# EAGLE design TCC_COMPLETO-jalim3 (EAGLE 4.16)
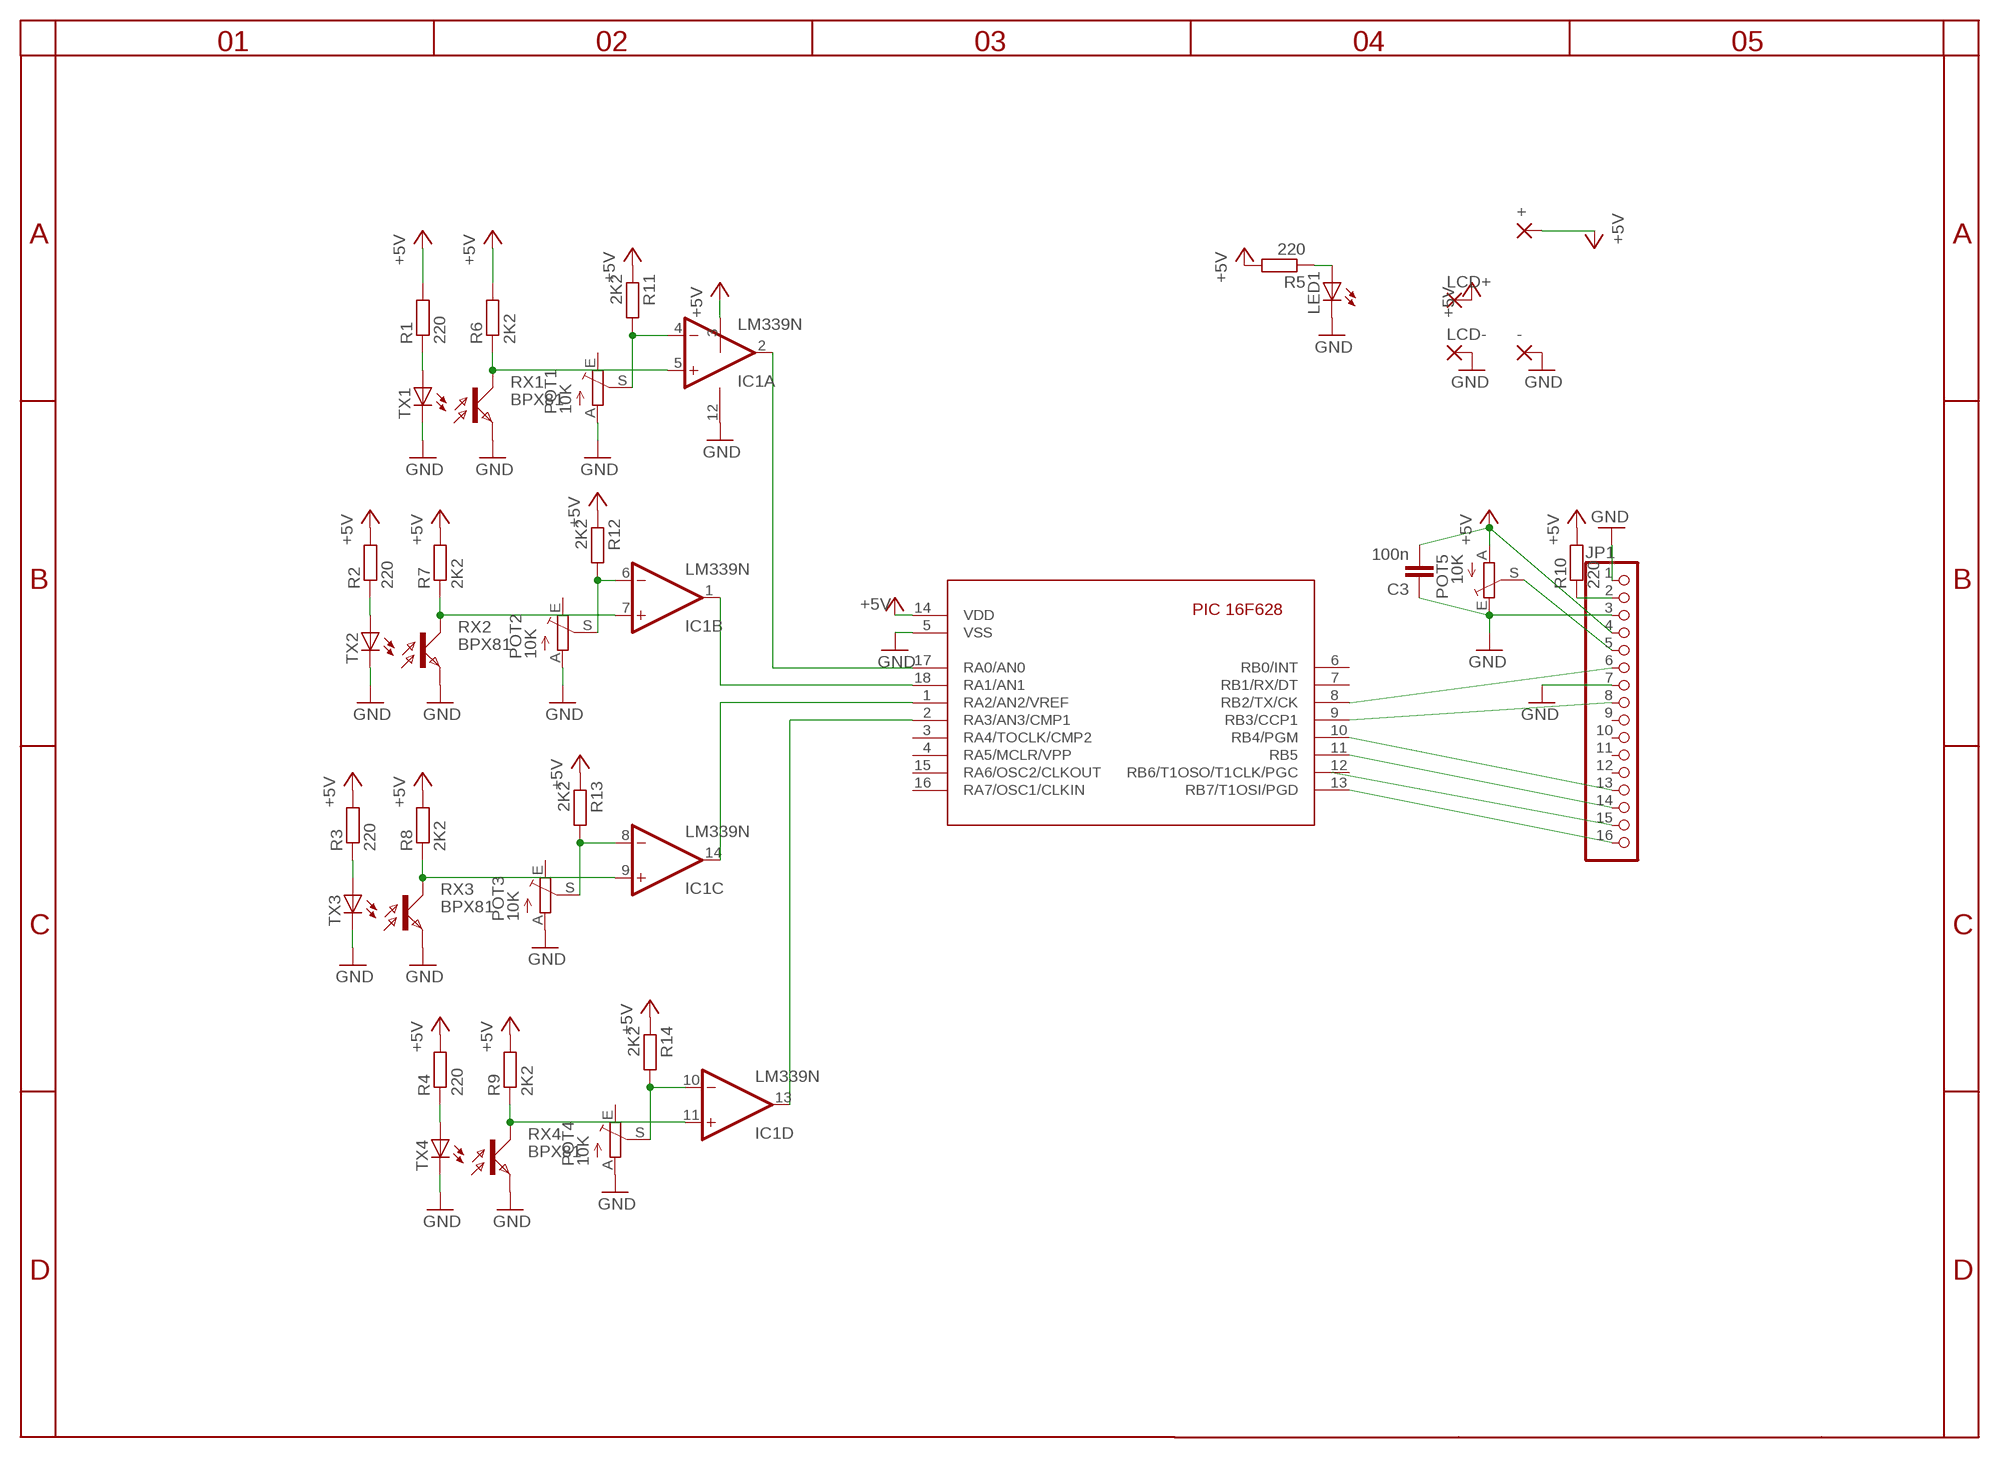
[diagram p0: schematic, sheet 1]

## Parts
+  2,54/1,0  [2,54/1,0]
-  2,54/1,0  [2,54/1,0]
C3  100n  CYYC7B5  [YC7B5]
IC1  LM339N  [DIL14]
JP1  PINHD-1X16  [1X16]
LCD+  2,54/1,0  [2,54/1,0]
LCD-  2,54/1,0  [2,54/1,0]
LED1  LED5MM  [LED5MM]
POT1  10K  TRIM_EU-LI10  [LI10]
POT2  10K  TRIM_EU-LI10  [LI10]
POT3  10K  TRIM_EU-LI10  [LI10]
POT4  10K  TRIM_EU-LI10  [LI10]
POT5  10K  TRIM_EU-LI10  [LI10]
R1  220  R-EU_0207/10  [0207/10]
R2  220  R-EU_0207/10  [0207/10]
R3  220  R-EU_0207/10  [0207/10]
R4  220  R-EU_0207/10  [0207/10]
R5  220  R-EU_0207/10  [0207/10]
R6  2K2  R-EU_0207/10  [0207/10]
R7  2K2  R-EU_0207/10  [0207/10]
R8  2K2  R-EU_0207/10  [0207/10]
R9  2K2  R-EU_0207/10  [0207/10]
R10  220  R-EU_0207/10  [0207/10]
R11  2K2  R-EU_0207/10  [0207/10]
R12  2K2  R-EU_0207/10  [0207/10]
R13  2K2  R-EU_0207/10  [0207/10]
R14  2K2  R-EU_0207/10  [0207/10]
RX1  BPX81  [BPX81]
RX2  BPX81  [BPX81]
RX3  BPX81  [BPX81]
RX4  BPX81  [BPX81]
TX1  LED5MM  [LED5MM]
TX2  LED5MM  [LED5MM]
TX3  LED5MM  [LED5MM]
TX4  LED5MM  [LED5MM]
U$1  16F628  [PIC16F628-18-LEAD-PDIP]

## Nets
+5V: +.1(P) C3.2 IC1.3(P:V+) JP1.4 LCD+.1(P) POT5.A R1.2 R2.2 R3.2 R4.2 R5.2 R6.2 R7.2 R8.2 R9.2 R10.2 R11.1 R12.1 R13.1 R14.1 U$1.14(VDD)
GND: -.1(P) C3.1 IC1.12(P:GND) JP1.1 JP1.3 JP1.7 LCD-.1(P) LED1.K(C) POT1.A POT2.A POT3.A POT4.A POT5.E RX1.E RX2.E RX3.E RX4.E TX1.K(C) TX2.K(C) TX3.K(C) TX4.K(C) U$1.5(VSS)
N$1: JP1.6 U$1.8(RB2/TX/CK)
N$2: JP1.8 U$1.9(RB3/CCP1)
N$3: JP1.16 U$1.13(RB7/T1OSI/PGD)
N$4: JP1.15
N$5: JP1.14 U$1.11(RB5)
N$6: JP1.13 U$1.10(RB4/PGM)
N$8: LED1.A R5.1
N$9: JP1.2 R10.1
N$10: JP1.5 POT5.S
N$11: IC1.9(C:+IN) R8.1 RX3.C
N$12: IC1.4(A:-IN) POT1.S R11.2
N$13: IC1.6(B:-IN) POT2.S R12.2
N$14: IC1.8(C:-IN) POT3.S R13.2
N$15: IC1.10(D:-IN) POT4.S R14.2
N$18: R1.1 TX1.A
N$19: R2.1 TX2.A
N$20: R3.1 TX3.A
N$21: R4.1 TX4.A
N$22: IC1.5(A:+IN) R6.1 RX1.C
N$24: IC1.11(D:+IN) R9.1 RX4.C
N$26: IC1.2(A:OUT) U$1.17(RA0/AN0)
N$31: IC1.1(B:OUT) U$1.18(RA1/AN1)
N$32: IC1.14(C:OUT) U$1.1(RA2/AN2/VREF)
N$33: IC1.13(D:OUT) U$1.2(RA3/AN3/CMP1)
N$34: IC1.7(B:+IN) R7.1 RX2.C
Unconnected: JP1.9 JP1.10 JP1.11 JP1.12 POT1.E POT2.E POT3.E POT4.E U$1.3(RA4/TOCLK/CMP2) U$1.4(RA5/MCLR/VPP) U$1.6(RB0/INT) U$1.7(RB1/RX/DT) U$1.12(RB6/T1OSO/T1CLK/PGC) U$1.15(RA6/OSC2/CLKOUT) U$1.16(RA7/OSC1/CLKIN)

## Library data of the parts
+ - LCD+ LCD- = wirepad:2,54/1,0: THROUGH-HOLE PAD
C3 = rcl:CY: Y CAPACITOR for power line
IC1 = linear:LM339: Low Power Low Offset Voltage Quad Comparators with open collector; LM139/LM239/LM339/LM2901/LM3302
JP1 = pinhead:PINHD-1X16: PIN HEADER
LED1 TX1-TX4 = led:LED: LED OSRAM: - CHIPLED LG R971, LG N971, LY N971, LG Q971, LY Q971, LO R971, LY R971 LH N974, LH R974 LS Q976, LO Q976, LY Q976 LO Q996 - Hyper CHIPLED LW Q18S LB Q993, LB Q99A, LB R99A - SideLED LS A670, LO A670, LY A670, LG A670, LP A670 LB A673, LV A673, LT A673, LW A673 LH A674 LY A675 LS A676, LA A676, LO A676, LY A676, LW A676 LS A679, LY A679, LG A679 - Hyper Micro SIDELED® LS Y876, LA Y876, LO Y876, LY Y876 LT Y87S - SmartLED LW L88C, LW L88S LB L89C, LB L89S, LG L890 LS L89K, LO L89K, LY L89K LS L896, LA L896, LO L896, LY L896 - TOPLED LS T670, LO T670, LY T670, LG T670, LP T670 LSG T670, LSP T670, LSY T670, LOP T670, LYG T670 LG T671, LOG T671, LSG T671 LB T673, LV T673, LT T673, LW T673 LH T674 LS T676, LA T676, LO T676, LY T676, LB T676, LH T676, LSB T676, LW T676 LB T67C, LV T67C, LT T67C, LS T67K, LO T67K, LY T67K, LW E67C LS E67B, LA E67B, LO E67B, LY E67B, LB E67C, LV E67C, LT E67C LW T67C LS T679, LY T679, LG T679 LS T770, LO T770, LY T770, LG T770, LP T770 LB T773, LV T773, LT T773, LW T773 LH T774 LS E675, LA E675, LY E675, LS T675 LS T776, LA T776, LO T776, LY T776, LB T776 LHGB T686 LT T68C, LB T68C - Hyper Mini TOPLED® LB M676 - Mini TOPLED Santana® LG M470 LS M47K, LO M47K, LY M47K Source: http://www.osram.convergy.de - LUMILED® LXK2-PW12-R00, LXK2-PW12-S00, LXK2-PW14-U00, LXK2-PW14-V00 LXK2-PM12-R00, LXK2-PM12-S00, LXK2-PM14-U00 LXK2-PE12-Q00, LXK2-PE12-R00, LXK2-PE12-S00, LXK2-PE14-T00, LXK2-PE14-U00 LXK2-PB12-K00, LXK2-PB12-L00, LXK2-PB12-M00, LXK2-PB14-N00, LXK2-PB14-P00, LXK2-PB14-Q00 LXK2-PR12-L00, LXK2-PR12-M00, LXK2-PR14-Q00, LXK2-PR14-R00 LXK2-PD12-Q00, LXK2-PD12-R00, LXK2-PD12-S00 LXK2-PH12-R00, LXK2-PH12-S00 LXK2-PL12-P00, LXK2-PL12-Q00, LXK2-PL12-R00 Source: www.luxeon.com
POT1-POT5 = pot:TRIM_EU-: POTENTIOMETER
R1-R14 = rcl:R-EU_: RESISTOR, European symbol
RX1-RX4 = opto-trans-siemens:BPX81: PHOTO TRANSISTOR
U$1 = pic16f6xx-1:16F628: Microchip component PIC 16F628 Eric Magraner - eric_magraner@yahoo.fr 03/2004

## Board
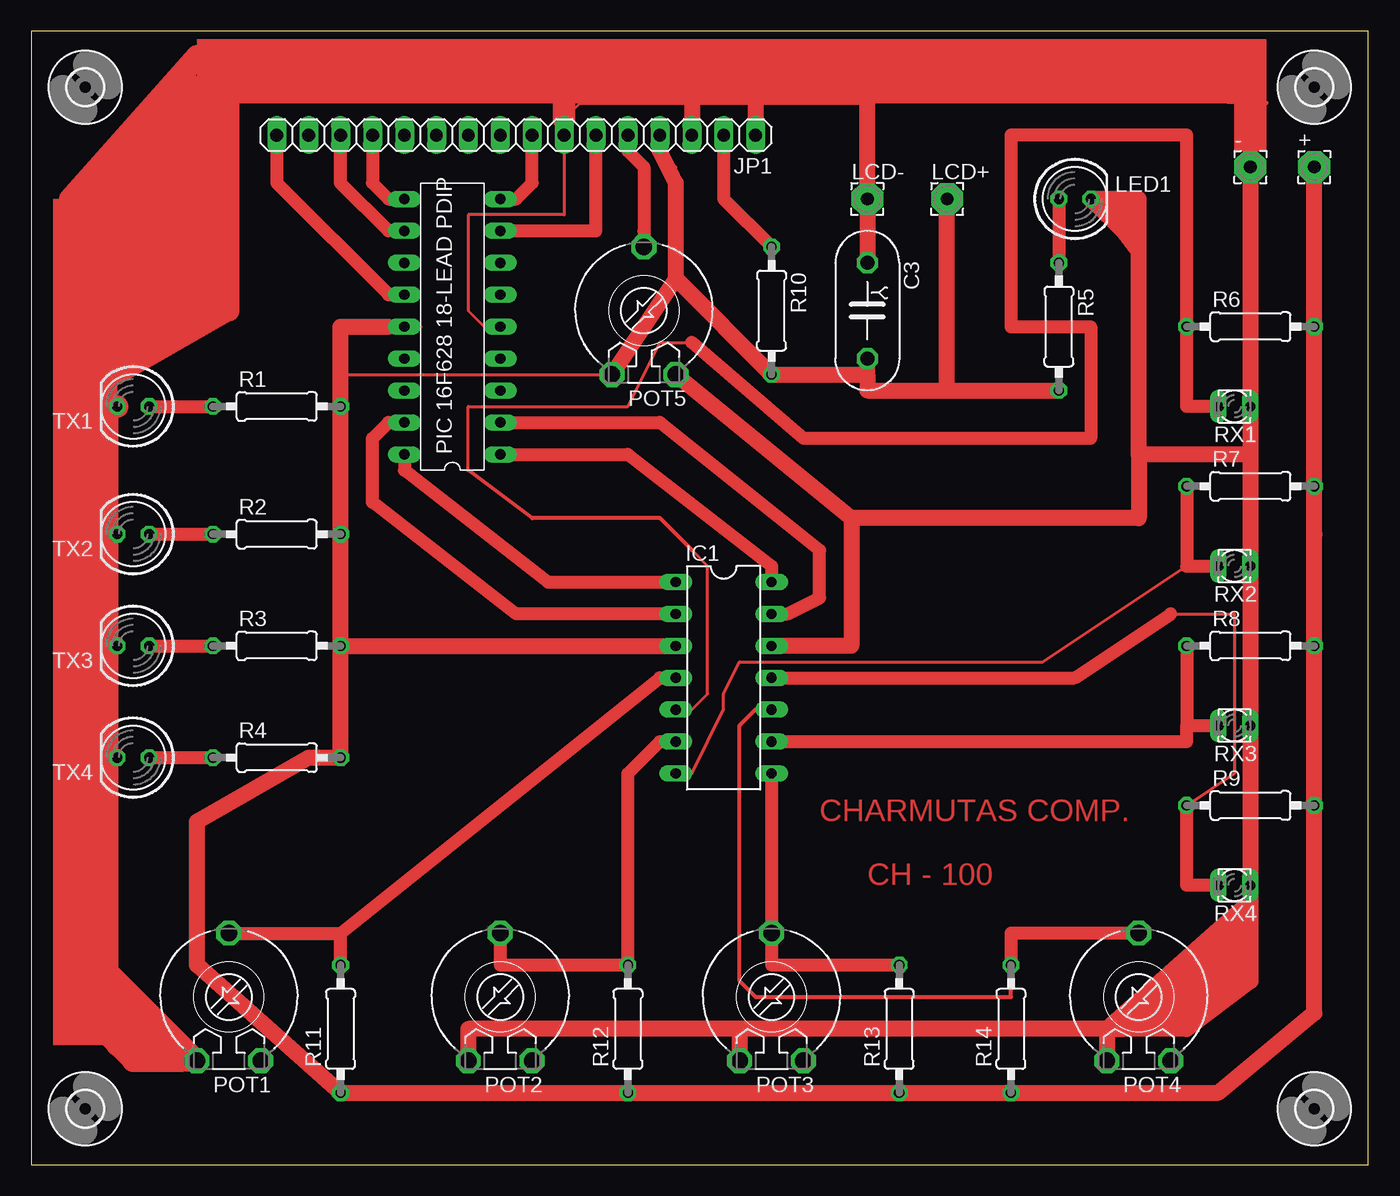
[diagram p1: board, top side]

Size 106.35 x 90.16 mm. Coordinates in mm from the lower left corner, seen from the top.
Outline: 0,0 106.35,0 106.35,90.16 0,90.16 0,0
Copper layers (1*16): Top 0.035mm / dielectric 1.5mm / Bottom 0.035mm
Design rules "default": minimum track width 10mil, minimum drill 24mil, track to track 8mil, track to pad 8mil, pad to pad 8mil, via to via 8mil, smd to smd 8mil, copper to edge 40mil, drill to drill 8mil, minimum pad ring 10mil, minimum via ring 8mil, stop-mask expansion 4mil, vias tented up to drill 0mil, thermal gap 10mil

### Footprints (pad centres in the part's own frame; a part is rotated, then mirrored left to right if it is on the bottom)
2,54/1,0 = drill 1.016 pad 2.54 octagon: 1 0,0
YC7B5 = drill 1.118 octagon: 1 -3.81,0; 2 3.81,0
DIL14 = drill 0.813 long: 1 -7.62,-3.81; 2 -5.08,-3.81; 3 -2.54,-3.81; 4 0,-3.81; 5 2.54,-3.81; 6 5.08,-3.81; 7 7.62,-3.81; 8 7.62,3.81; 9 5.08,3.81; 10 2.54,3.81; 11 0,3.81; 12 -2.54,3.81; 13 -5.08,3.81; 14 -7.62,3.81
1X16 = drill 1.016 long: 1 -19.05,0; 2 -16.51,0; 3 -13.97,0; 4 -11.43,0; 5 -8.89,0; 6 -6.35,0; 7 -3.81,0; 8 -1.27,0; 9 1.27,0; 10 3.81,0; 11 6.35,0; 12 8.89,0; 13 11.43,0; 14 13.97,0; 15 16.51,0; 16 19.05,0
LED5MM = drill 0.813 octagon: A -1.27,0; K 1.27,0
LI10 = drill 1.321 octagon: A -2.54,-5.08; E 2.54,-5.08; S 0,5.08
0207/10 = drill 0.813 octagon: 1 -5.08,0; 2 5.08,0
BPX81 = drill 0.813 long: C 1.27,0; E -1.27,0
PIC16F628-18-LEAD-PDIP = drill 0.813 long: 1 -10.16,-3.81; 2 -7.62,-3.81; 3 -5.08,-3.81; 4 -2.54,-3.81; 5 0,-3.81; 6 2.54,-3.81; 7 5.08,-3.81; 8 7.62,-3.81; 9 10.16,-3.81; 10 10.16,3.81; 11 7.62,3.81; 12 5.08,3.81; 13 2.54,3.81; 14 0,3.81; 15 -2.54,3.81; 16 -5.08,3.81; 17 -7.62,3.81; 18 -10.16,3.81
2,8 = hole 2.8: 0,0

### Placement (x,y rotation side)
+  102.07,79.37 0 top
-  96.99,79.37 0 top
C3  66.51,67.94 270 top
IC1  55.08,38.73 270 top
JP1  38.57,81.91 180 top
LCD+  72.86,76.83 0 top
LCD-  66.51,76.83 0 top
LED1  83.02,76.83 0 top
POT1  15.71,13.33 0 top
POT2  37.3,13.33 0 top
POT3  58.89,13.33 0 top
POT4  88.1,13.33 0 top
POT5  48.73,67.94 0 top
R1  19.52,60.32 0 top
R2  19.52,50.16 0 top
R3  19.52,41.27 0 top
R4  19.52,32.38 0 top
R5  81.75,66.67 270 top
R6  96.99,66.67 0 top
R7  96.99,53.97 0 top
R8  96.99,41.27 0 top
R9  96.99,28.57 0 top
R10  58.89,67.94 270 top
R11  24.6,10.79 90 top
R12  47.46,10.79 90 top
R13  69.05,10.79 90 top
R14  77.94,10.79 90 top
RX1  95.72,60.32 180 top
RX2  95.72,47.62 180 top
RX3  95.72,34.92 180 top
RX4  95.72,22.22 180 top
TX1  8.09,60.32 180 top
TX2  8.09,50.16 180 top
TX3  8.09,41.27 180 top
TX4  8.09,32.38 180 top
U$1  33.49,66.67 90 top
U$2  [2,8]  4.28,85.72 0 top
U$3  [2,8]  4.28,4.44 0 top
U$4  [2,8]  102.07,85.72 0 top
U$5  [2,8]  102.07,4.44 0 top

### Tracks (layer width: path | path; a pad name or v marks a point on that pad's centre or on a via)
+5V
  Top 0.254: 50,80.64 51.27,79.37 51.27,78.1 | 66.51,61.59 72.86,61.59 | R4.2 R3.2 | R3.2 IC1.3 | R3.2 R2.2 R1.2 | 24.6,62.86 POT5.A | R11.1 R12.1 R13.1 R14.1 94.45,5.71 | +.1 R6.2 R7.2 102.07,50.16 R8.2 R9.2 102.07,12.06 | 30.95,66.67 U$1.14
  Top 0.305: 28.41,66.67 30.95,66.67
  Top 1.27: +.1 102.07,50.16 102.07,12.06 94.45,5.71 R11.1 13.17,15.87 13.17,27.3 22.06,32.38 R4.2 R3.2 | R3.2 R1.2 | R3.2 R1.2 | R3.2 IC1.3 | R1.2 24.6,62.86 24.6,66.67 28.41,66.67 | LCD+.1 72.86,61.59 R5.2 66.51,61.59 66.51,62.86 | 66.51,62.86 C3.2 | 66.51,62.86 R10.2 51.27,70.48 | 51.27,70.48 51.27,78.1 50,80.64 JP1.4 | POT5.A 51.27,70.48
GND
  Top 0.254: RX3.E RX4.E | 96.99,19.68 85.56,10.79 | TX1.K TX2.K TX3.K TX4.K 6.82,14.6 | U$1.5 36.03,66.67 34.76,67.94 34.76,75.56 42.38,75.56 JP1.7 42.38,83.18 43.65,84.45 52.54,84.45 57.62,84.45 | C3.1 LCD-.1 66.51,84.45 57.62,84.45 | IC1.12 60.16,41.27 | 96.99,59.05 RX1.E -.1 96.99,84.45 67.78,85.72 57.62,84.45 | LED1.K 88.1,71.75 88.1,70.48
  Top 0.305: POT1.A 6.82,14.6 | 6.82,9.52 5.55,14.6 8.09,8.25 6.82,12.06 5.55,12.06 | 93.18,85.72 91.91,85.72 98.26,84.45
  Top 1.016: 88.1,12.06 90.64,13.33
  Top 1.27: -.1 96.99,59.05 96.99,56.51 | 96.99,56.51 RX2.E RX3.E RX4.E 96.99,20.95 | 85.56,10.79 POT4.A | 96.99,20.95 85.56,10.79 | 96.99,20.95 96.99,14.6 | 96.99,14.6 91.91,10.79 | 85.56,10.79 86.83,10.79 | 91.91,10.79 86.83,10.79 | 91.91,10.79 88.1,12.06 | 86.83,10.79 88.1,12.06 | 88.1,12.06 89.37,12.06 | 96.99,14.6 89.37,12.06 | 96.99,14.6 95.72,15.87 | 95.72,18.41 95.72,17.14 95.72,15.87 | 95.72,18.41 94.45,17.14 | 94.45,17.14 93.18,15.87 | 90.64,13.33 93.18,15.87 | 89.37,12.06 90.64,13.33 | 90.64,13.33 91.91,14.6 91.91,15.87 89.37,13.33 90.64,13.33 | 90.64,13.33 91.91,13.33 93.18,13.33 | 96.99,14.6 94.45,13.33 94.45,14.6 94.45,15.87 | 96.99,14.6 93.18,13.33 | 93.18,13.33 93.18,14.6 93.18,15.87 | 95.72,15.87 94.45,15.87 | 94.45,15.87 93.18,15.87 | 94.45,17.14 95.72,15.87 | 94.45,15.87 94.45,17.14 | 96.99,14.6 95.72,14.6 | 96.99,20.95 96.99,19.68 96.99,14.6 | 96.99,20.95 95.72,19.68 95.72,18.41 | 85.56,10.79 56.35,10.79 | 56.35,10.79 34.76,10.79 POT2.A | 56.35,10.79 POT3.A | 96.99,56.51 88.1,56.51 | 88.1,56.51 88.1,70.48 88.1,73.02 | 88.1,73.02 85.56,75.56 | 85.56,75.56 LED1.K 88.1,76.83 | 88.1,73.02 88.1,76.83 | 88.1,73.02 88.1,74.29 86.83,75.56 | 85.56,75.56 86.83,75.56 | 88.1,76.83 86.83,75.56 | 88.1,56.51 88.1,51.43 65.24,51.43 | IC1.12 65.24,41.27 65.24,51.43 | 65.24,51.43 POT5.E | JP1.3 52.54,84.45 52.54,85.72 | 66.51,85.72 LCD-.1 C3.1 | POT1.A 11.9,8.25 4.28,14.6 3.01,13.33 6.82,10.79 9.36,8.25 4.28,12.06 | JP1.1 57.62,84.45 57.62,85.72 | 67.78,85.72 93.18,85.72
  Top 1.676: 94.45,13.33 93.18,13.33 91.91,12.06 90.64,12.06 | 91.91,13.33 93.18,14.6 94.45,15.87 95.72,17.14 | 95.72,14.6 94.45,14.6 | 5.55,10.79 8.09,8.25 | 9.36,8.25 POT1.A 5.55,15.87
  Top 1.778: 5.55,12.06 5.55,14.6 11.9,8.25 9.36,8.25 | 9.36,8.25 8.09,8.25 8.09,10.79 6.82,10.79 | 6.82,10.79 8.09,9.52 | 6.82,10.79 6.82,12.06 9.36,9.52 9.36,8.25 | 6.82,9.52 6.82,10.79 | TX1.K 4.28,60.32 4.28,76.83 | 14.44,85.72 42.38,85.72 | 42.38,85.72 43.65,85.72 | 42.38,85.72 42.38,83.18 | 66.51,85.72 57.62,85.72 52.54,85.72 14.44,85.72 | 67.78,85.72 66.51,85.72 | 66.51,85.72 14.44,85.72 | 14.44,85.72 4.28,76.83 | 13.17,85.72 4.28,76.83 | 4.28,76.83 3.01,65.4
N$1
  Top 1.016: U$1.8 44.92,74.29 JP1.6
N$2
  Top 1.016: U$1.9 38.57,76.83 39.84,78.1 JP1.8
N$3
  Top 1.016: JP1.16 19.52,78.1 28.41,69.21 U$1.13
N$5
  Top 1.016: U$1.11 28.41,74.29 24.6,78.1 JP1.14
N$6
  Top 1.016: JP1.13 27.14,78.1 28.41,76.83 U$1.10
N$7
  Top 1.676: 13.17,88.26 5.55,76.83 3.01,76.83 13.17,88.26
N$8
  Top 0.254: R5.1 LED1.A
  Top 1.016: LED1.A R5.1
N$9
  Top 1.016: JP1.2 55.08,76.83 R10.1
N$10
  Top 0.254: 47.46,80.64 JP1.5
  Top 1.016: 47.46,80.64 48.73,79.37 48.73,74.29 POT5.S
N$11
  Top 1.016: R8.1 91.91,34.92 | IC1.9 91.91,33.65 91.91,34.92 | 91.91,34.92 RX3.C
N$12
  Top 1.016: R11.2 24.6,18.41 | POT1.S 24.6,18.41 | 24.6,18.41 50,38.73 IC1.4
N$13
  Top 1.016: POT2.S 37.3,15.87 R12.2 47.46,31.11 50,33.65 IC1.6
N$14
  Top 0.254: IC1.8 POT3.S 58.89,15.87
  Top 1.016: IC1.8 58.89,15.87 R13.2
N$15
  Top 0.254: 57.62,36.19 IC1.10
  Top 0.305: R14.2 77.94,13.33 57.62,13.33 56.35,14.6 56.35,34.92 57.62,36.19
  Top 1.016: POT4.S 77.94,18.41 R14.2
N$16
  Top 0.305: 20.79,86.99 37.3,86.99
  Top 1.27: 19.52,86.99 37.3,86.99 95.72,86.99
N$17
  Top 0.406: 11.9,80.64 8.09,75.56 13.17,80.64 13.17,76.83
  Top 1.676: 5.55,75.56 15.71,85.72 | 16.98,86.99 15.71,85.72 | 15.71,85.72 15.71,67.94 6.82,62.86 6.82,78.1 14.44,83.18 14.44,67.94 8.09,64.13 8.09,75.56 8.09,76.83 11.9,80.64 13.17,81.91 13.17,80.64 13.17,79.37 | 13.17,79.37 13.17,76.83 13.17,69.21 10.63,66.67 | 10.63,66.67 9.36,65.4 9.36,75.56 10.63,76.83 | 10.63,76.83 11.9,78.1 | 11.9,78.1 13.17,79.37 | 13.17,79.37 10.63,66.67 | 10.63,66.67 10.63,76.83 | 10.63,76.83 13.17,67.94 11.9,78.1
N$18
  Top 0.254: TX1.A R1.1
  Top 1.016: TX1.A R1.1
N$19
  Top 0.254: TX2.A R2.1
  Top 1.016: TX2.A R2.1
N$20
  Top 0.254: TX3.A R3.1
  Top 1.016: TX3.A R3.1
N$21
  Top 0.254: TX4.A R4.1
  Top 1.016: TX4.A R4.1
N$22
  Top 0.254: 51.27,50.16 52.54,48.89 53.81,47.62 53.81,37.46 52.54,36.19 IC1.5 | 34.76,55.24 34.76,60.32 47.46,60.32 50,65.4 52.54,65.4 | 91.91,80.64 R6.1 91.91,60.32
  Top 0.305: 34.76,55.24 39.84,51.43 50,51.43 52.54,48.89
  Top 1.016: RX1.C 91.91,60.32 91.91,80.64 91.91,81.91 77.94,81.91 77.94,66.67 84.29,66.67 84.29,57.78 61.43,57.78 52.54,65.4
N$24
  Top 0.254: 90.64,43.81 95.72,43.81 95.72,31.11 R9.1
  Top 1.016: IC1.11 83.02,38.73 90.64,43.81 | RX4.C 91.91,22.22 R9.1
N$26
  Top 1.016: IC1.2 38.57,43.81 27.14,52.7 27.14,57.78 28.41,59.05 U$1.17
N$31
  Top 1.016: U$1.18 29.68,55.24 41.11,46.35 IC1.1
N$32
  Top 1.016: U$1.1 47.46,56.51 58.89,47.62 IC1.14
N$33
  Top 1.016: U$1.2 50,59.05 62.7,48.89 62.7,45.08 60.16,43.81 IC1.13
N$34
  Top 0.254: 91.91,47.62 80.48,40 56.35,40 55.08,37.46 55.08,36.19 52.54,31.11 IC1.7
  Top 1.016: R7.1 91.91,47.62 RX2.C
(copper drawn outside any net)
  shapes: Top area x13

### Text on the board
Top: CHARMUTAS COMP. | CH - 100